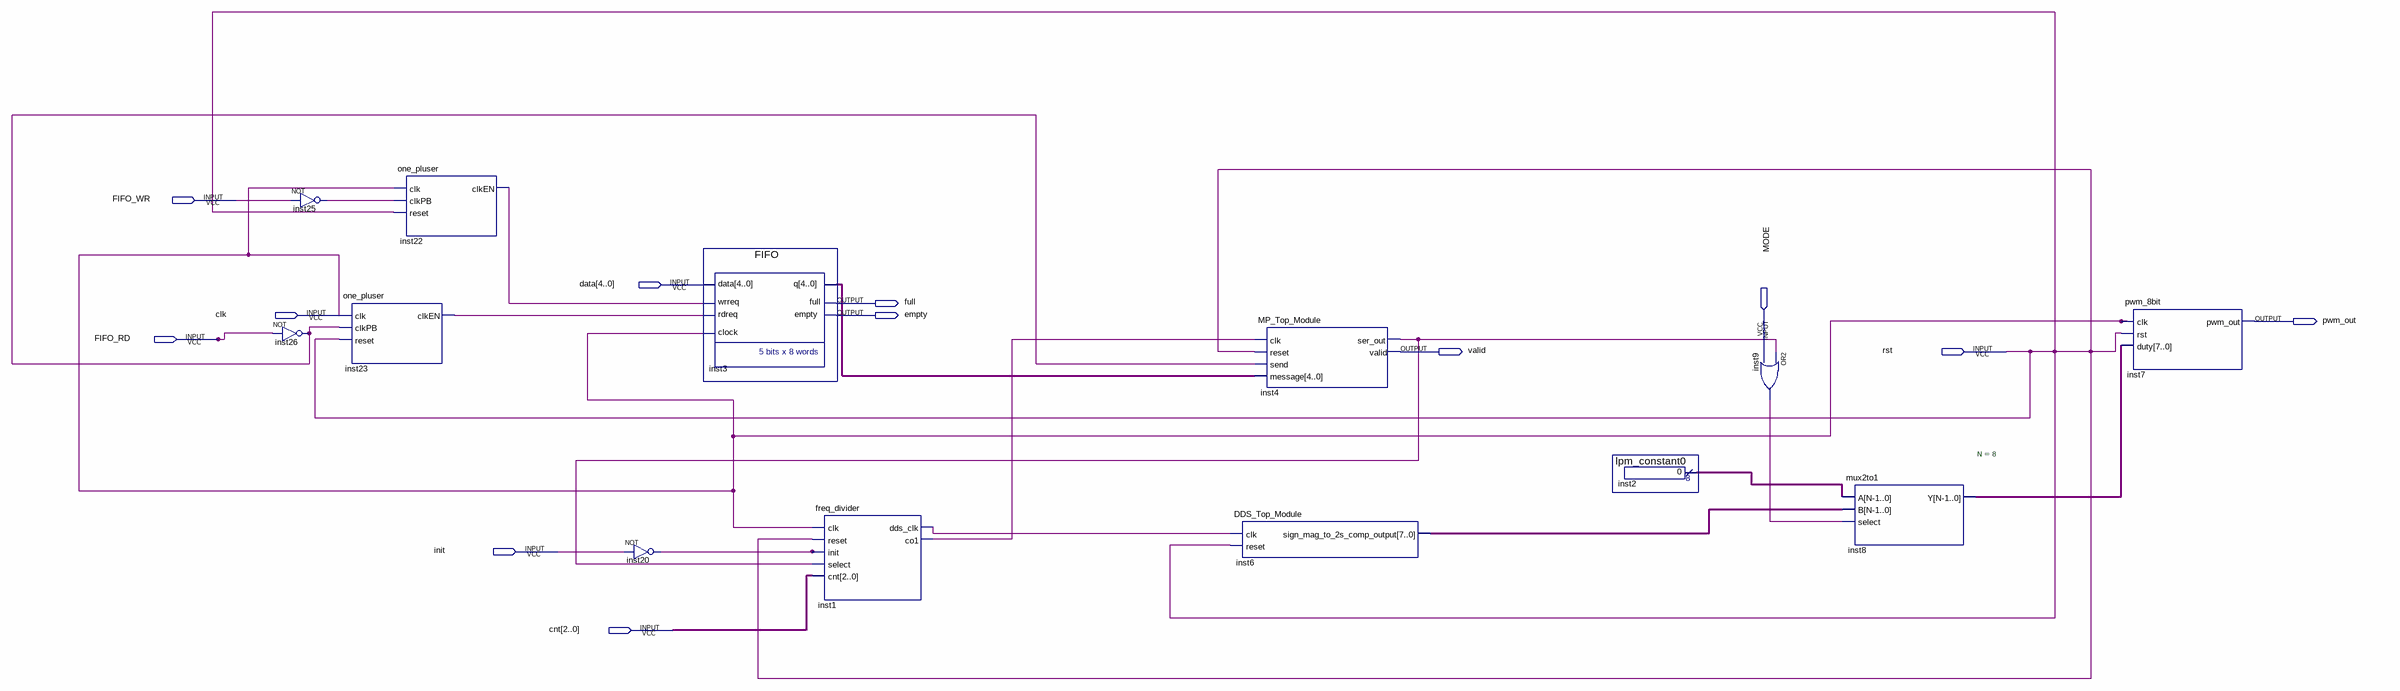
[diagram p0: schematic sheet]
// Quartus schematic Top_Module.bdf as structural Verilog: 13 symbols, 12 pins
module Top_Module (
  input  FIFO_WR,
  input  [4:0] data,
  input  clk,
  input  FIFO_RD,
  input  MODE,
  input  rst,
  input  init,
  input  [2:0] cnt,
  output full,
  output empty,
  output pwm_out,
  output valid
);

  wire inst1_co1, inst1_dds_clk, inst4_ser_out, inst9_out, inst20_out, inst22_clken, inst23_clken,
       inst25_out, inst26_out;
  wire [4:0] inst3_q;
  wire [7:0] inst2_result, inst6_sign_mag_to_2s_comp_output, inst8_y;

  not inst25 (inst25_out, FIFO_WR);
  not inst26 (inst26_out, FIFO_RD);
  one_pluser inst23 (.clk(clk), .clkPB(inst26_out), .reset(rst), .clkEN(inst23_clken));
  one_pluser inst22 (.clk(clk), .clkPB(inst25_out), .reset(rst), .clkEN(inst22_clken));
  not inst20 (inst20_out, init);
  FIFO inst3 (
    .data(data), .wrreq(inst22_clken), .rdreq(inst23_clken), .clock(clk), .q(inst3_q), .full(full),
    .empty(empty));
  freq_divider inst1 (
    .clk(clk), .reset(rst), .init(inst20_out), .select(inst4_ser_out), .cnt(cnt), .dds_clk(inst1_dds_clk),
    .co1(inst1_co1));
  DDS_Top_Module inst6 (
    .clk(inst1_dds_clk), .reset(rst), .sign_mag_to_2s_comp_output(inst6_sign_mag_to_2s_comp_output));
  MP_Top_Module inst4 (
    .clk(inst1_co1), .reset(rst), .send(inst26_out), .message(inst3_q), .ser_out(inst4_ser_out), .valid(valid));
  lpm_constant0 inst2 (.result(inst2_result));
  or inst9 (inst9_out, inst4_ser_out, MODE);
  mux2to1 #(.N(8)) inst8 (.A(inst2_result), .B(inst6_sign_mag_to_2s_comp_output), .select(inst9_out), .Y(inst8_y));
  pwm_8bit inst7 (.clk(clk), .rst(rst), .duty(inst8_y), .pwm_out(pwm_out));
endmodule
